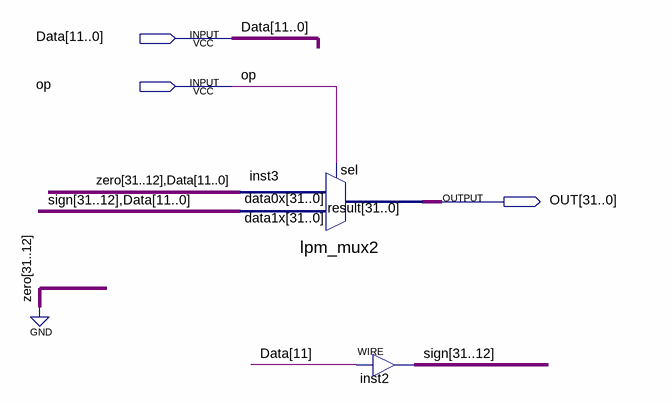
[diagram p0: schematic sheet]
// Quartus schematic ExtU.bdf as structural Verilog: 2 symbols, 3 pins
module ExtU (
  input  [11:0] Data,
  input  op,
  output [31:0] OUT
);

  wire [31:12] sign;

  lpm_mux2 inst3 (.data1x({sign, Data}), .data0x({{20{1'b0}}, Data}), .sel(op), .result(OUT));
  assign sign = {20{Data[11]}};  // WIRE inst2
endmodule
